# EAGLE design alimentadorV4 (EAGLE 6.6.0)
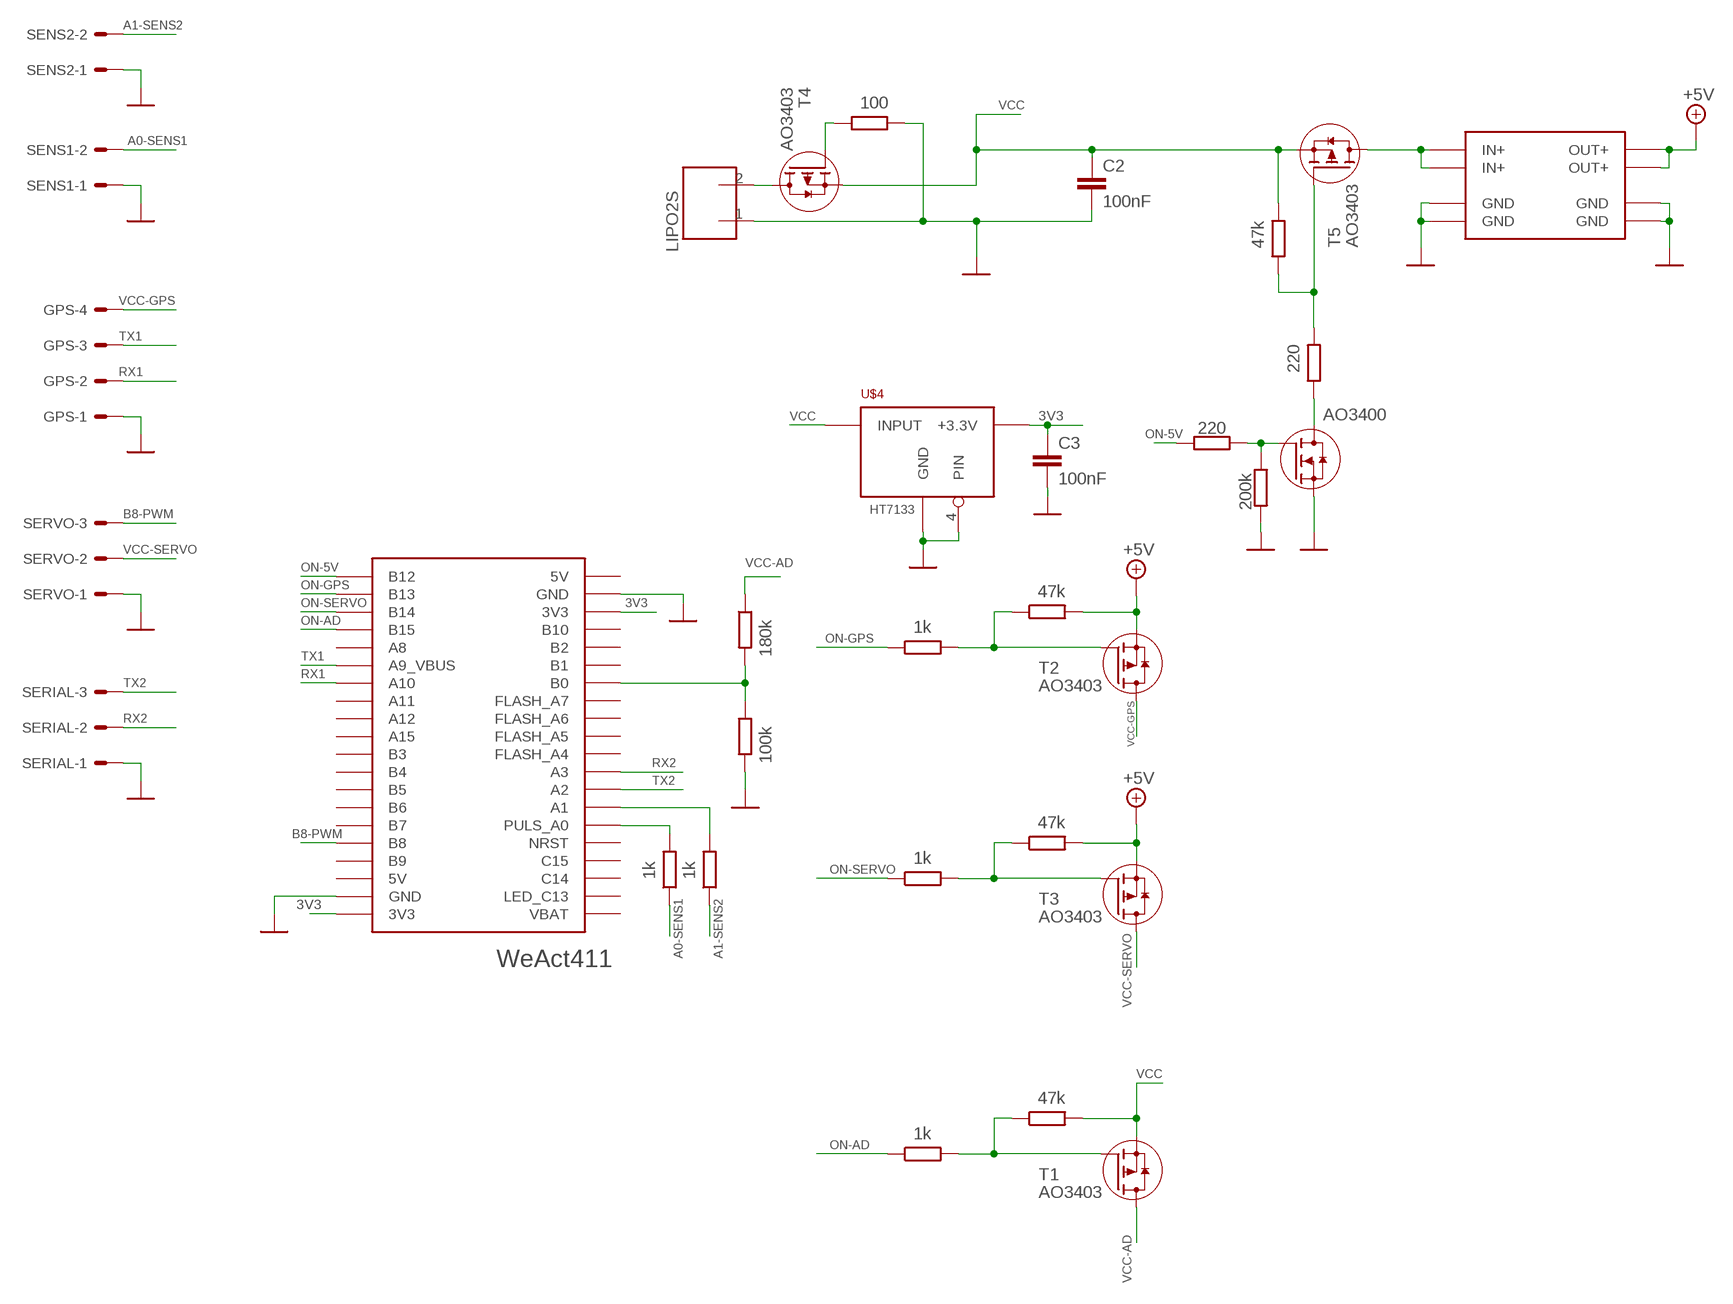
[diagram p0: schematic, sheet 1]

## Parts
C2  100nF  C-EUC1206  [C1206]
C3  100nF  C-EUC1206  [C1206]
GPS  22-27-2041-04  [6410-04]
LIPO2S  CONECTOR_2P-3.81  [CON2P-3.81]
R1  47k  R-EU_R1206  [R1206]
R2  100k  R-EU_R1206  [R1206]
R3  180k  R-EU_R1206  [R1206]
R4  1k  R-EU_R1206  [R1206]
R5  47k  R-EU_R1206  [R1206]
R6  1k  R-EU_R1206  [R1206]
R7  100  R-EU_R1206  [R1206]
R8  47k  R-EU_R1206  [R1206]
R9  220  R-EU_R1206  [R1206]
R10  220  R-EU_R1206  [R1206]
R11  47k  R-EU_R1206  [R1206]
R12  1k  R-EU_R1206  [R1206]
R13  1k  R-EU_R1206  [R1206]
R14  1k  R-EU_R1206  [R1206]
R15  200k  R-EU_R1206  [R1206]
SENS1  22-27-2021-02  [6410-02]
SENS2  22-27-2021-02  [6410-02]
SERIAL  22-27-2031-03  [6410-03]
SERVO  22-27-2031-03  [6410-03]
T1  AO3403  [SOT23]
T2  AO3403  [SOT23]
T3  AO3403  [SOT23]
T4  AO3403  [SOT23]
T5  AO3403  [SOT23]
U$1  AO3400  [SOT23]
U$2  WEACT411  [WEACT411]
U$3  REG12TO5  [REG12TO5]
U$4  HT7133  [SOT89]

## Nets
3V3: C3.1 U$2.3V3@1(3V3) U$2.3V3@2(3V3) U$4.2(+3.3V)
+5V: R1.2 R5.2 T2.2(S) T3.2(S) U$3.OUT+@1(OUT+) U$3.OUT+@2(OUT+)
A0-SENS1: R13.1 SENS1.2
A1-SENS2: R14.1 SENS2.2
B8-PWM: SERVO.3 U$2.B8
GND [pwr]: C2.2 C3.2 GPS.1 LIPO2S.1 R2.2 R7.2 R15.2 SENS1.1 SENS2.1 SERIAL.1 SERVO.1 U$1.2(S) U$2.GND@1(GND) U$2.GND@2(GND) U$3.GND@1(GND) U$3.GND@2(GND) U$3.GND@3(GND) U$3.GND@4(GND) U$4.3(GND) U$4.4(PIN)
KK: T5.3(D) U$3.IN+@1(IN+) U$3.IN+@2(IN+)
N$1: LIPO2S.2 T4.3(D)
N$2: R2.1 R3.2 U$2.B0
N$3: R7.1 T4.1(G)
N$4: R8.1 R9.2 T5.1(G)
N$5: R1.1 R4.2 T2.1(G)
N$6: R11.1 R12.2 T1.1(G)
N$7: R10.1 R15.1 U$1.1(G)
N$8: R5.1 R6.2 T3.1(G)
N$9: R13.2 U$2.A0(PULS_A0)
N$11: R14.2 U$2.A1
ON-5V: R10.2 U$2.B12
ON-AD: R12.1 U$2.B15
ON-GPS: R4.1 U$2.B13
ON-SERVO: R6.1 U$2.B14
RX1: GPS.2 U$2.A10
RX2: SERIAL.2 U$2.A3
TX1: GPS.3 U$2.A9(A9_VBUS)
TX2: SERIAL.3 U$2.A2
UU: R9.1 U$1.3(D)
VCC: C2.1 R8.2 R11.2 T1.2(S) T4.2(S) T5.2(S) U$4.1(INPUT)
VCC-AD: R3.1 T1.3(D)
VCC-GPS: GPS.4 T2.3(D)
VCC-SERVO: SERVO.2 T3.3(D)
Unconnected: U$2.5V@1(5V) U$2.5V@2(5V) U$2.A4(FLASH_A4) U$2.A5(FLASH_A5) U$2.A6(FLASH_A6) U$2.A7(FLASH_A7) U$2.A8 U$2.A11 U$2.A12 U$2.A15 U$2.B1 U$2.B2 U$2.B3 U$2.B4 U$2.B5 U$2.B6 U$2.B7 U$2.B9 U$2.B10 U$2.C13(LED_C13) U$2.C14 U$2.C15 U$2.NRST U$2.VBAT

## Library data of the parts
C2 C3 = rcl:C-EU: CAPACITOR, European symbol
GPS = con-molex:22-?-04: CONNECTOR wire to board 2.54 mm (.1 inch) pitch header; OC_FARNELL: unknown; OC_NEWARK: unknown
LIPO2S = jcf:CONECTOR_2P-3.81
R1-R15 = rcl:R-EU_: RESISTOR, European symbol
SENS1 SENS2 = con-molex:22-?-02: CONNECTOR wire to board 2.54 mm (.1 inch) pitch header; OC_FARNELL: unknown; OC_NEWARK: unknown
SERIAL SERVO = con-molex:22-?-03: CONNECTOR wire to board 2.54 mm (.1 inch) pitch header; OC_FARNELL: unknown; OC_NEWARK: unknown
T1-T5 = jcf:AO3403: AO3403 P-channel MOSFET 2.6A 30V
U$1 = jcf:AO3400: A3400 MOSFET-N 30V 5.8A 52mohm@Vgs2.5
U$2 = jcf:WEACT411: WeAct STM32F411
U$3 = jcf:REG12TO5: Regulador 12 a 5V
U$4 = jcf:HT7133: HT73333 Regulador LDO 3.3V Vinput max. 12V Iquiescent 4uA Imax 250mA

## Net classes
0 default: width 0.241 mm, drill 0.584 mm, clearance 0.241 mm
1 pwr: width 0.25 mm

## Board
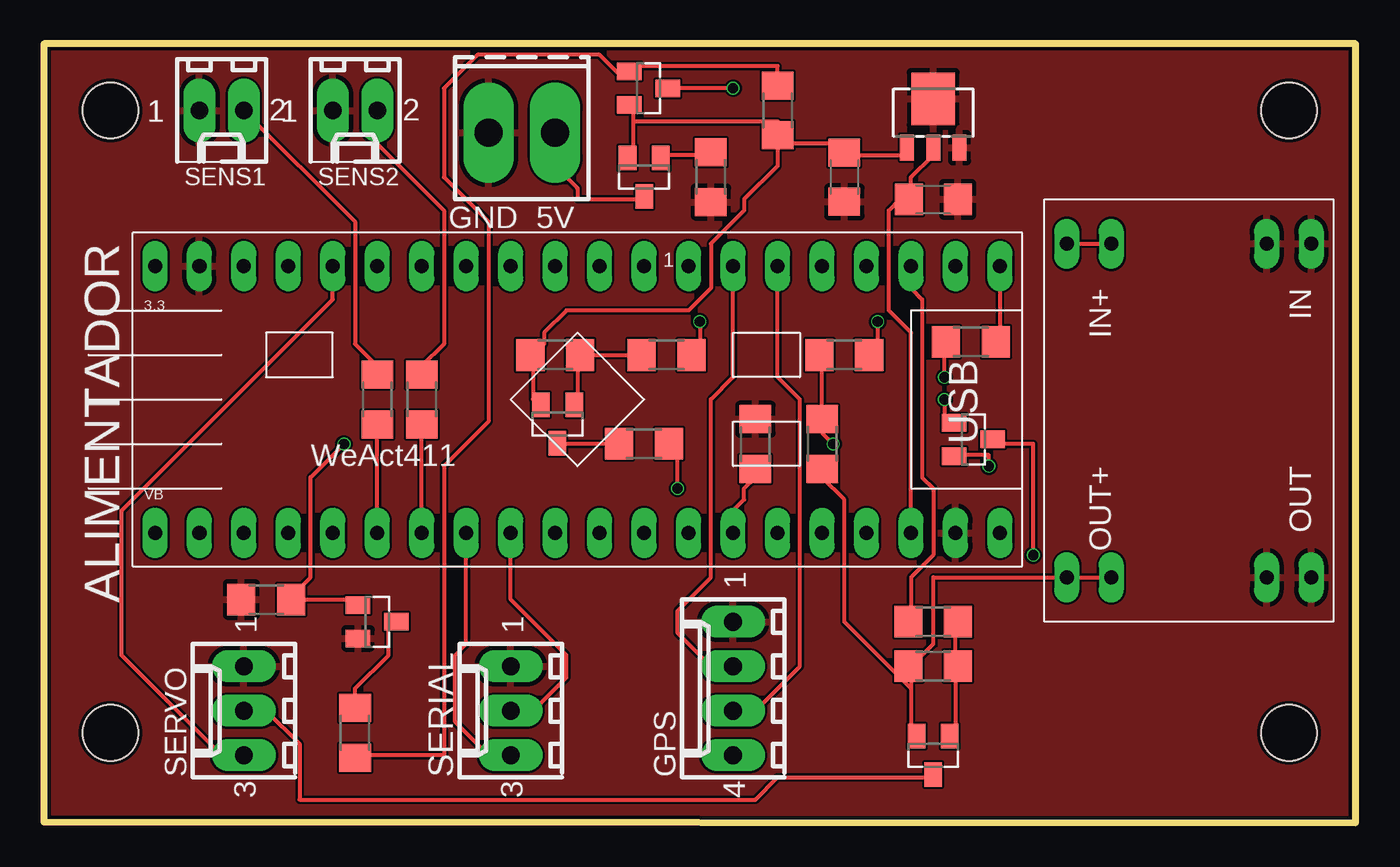
[diagram p1: board, top side]
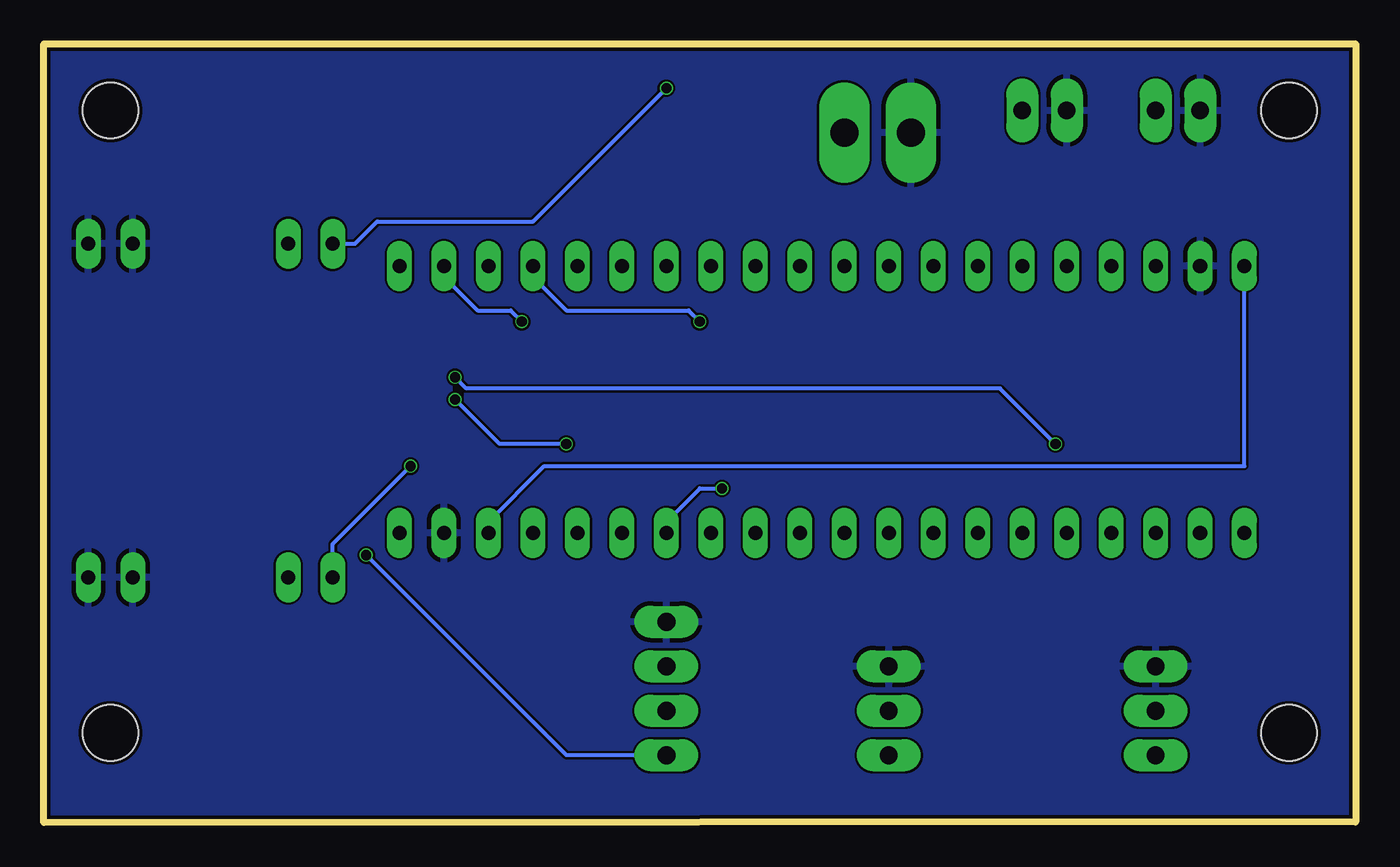
[diagram p2: board, bottom side, seen from below]

Size 74.93 x 44.5 mm. Coordinates in mm from the lower left corner, seen from the top.
Outline: 0,44.5 0,0.05 74.93,0 74.93,44.5 0,44.5
Copper layers (1*16): Top 0.035mm / dielectric 1.6mm / Bottom 0.035mm
Design rules "jlcpcb-2layers": minimum track width 5mil, minimum drill 0.3mm, track to track 5mil, track to pad 5mil, pad to pad 5mil, via to via 5mil, smd to smd 5mil, copper to edge 0.2mm, drill to drill 6mil, minimum pad ring 10mil, minimum via ring 3mil, stop-mask expansion 4mil, vias tented up to drill 0mil, thermal gap 10mil
Holes 3.2 mm at 71.12,5.13 3.81,5.13 71.12,40.69 3.81,40.69

### Footprints (pad centres in the part's own frame; a part is rotated, then mirrored left to right if it is on the bottom)
C1206 = smd 1.6 x 1.8: 1 -1.4,0; 2 1.4,0
6410-04 = drill 1.016 long: 1 3.81,0; 2 1.27,0; 3 -1.27,0; 4 -3.81,0
CON2P-3.81 = drill 1.6 long: 1 0,0; 2 3.81,0
R1206 = smd 1.6 x 1.803: 1 -1.422,0; 2 1.422,0
6410-02 = drill 1.016 long: 1 1.27,0; 2 -1.27,0
6410-03 = drill 1.016 long: 1 2.54,0; 2 0,0; 3 -2.54,0
SOT23 = smd 1 x 1.4: 1 -0.95,-1.1; 2 0.95,-1.1; 3 0,1.1
WEACT411 = drill 0.8 long: 3V3@1 43.18,0; 3V3@2 0,15.24; 5V@1 48.26,0; 5V@2 5.08,15.24; A0 12.7,0; A1 15.24,0; A2 17.78,0; A3 20.32,0; A4 22.86,0; A5 25.4,0; A6 27.94,0; A7 30.48,0; A8 38.1,15.24; A9 35.56,15.24; A10 33.02,15.24; A11 30.48,15.24; A12 27.94,15.24; A15 25.4,15.24; B0 33.02,0; B1 35.56,0; B2 38.1,0; B3 22.86,15.24; B4 20.32,15.24; B5 17.78,15.24; B6 15.24,15.24; B7 12.7,15.24; B8 10.16,15.24; B9 7.62,15.24; B10 40.64,0; B12 48.26,15.24; B13 45.72,15.24; B14 43.18,15.24; B15 40.64,15.24; C13 2.54,0; C14 5.08,0; C15 7.62,0; GND@1 45.72,0; GND@2 2.54,15.24; NRST 10.16,0; VBAT 0,0
REG12TO5 = drill 0.8 long: GND@1 0,11.43; GND@2 0,13.97; GND@3 19.05,11.43; GND@4 19.05,13.97; IN+@1 0,0; IN+@2 0,2.54; OUT+@1 19.05,0; OUT+@2 19.05,2.54
SOT89 = smd 0.8 x 1.5: 1 -1.5,-1.75; 2 0,-1.75; 3 1.5,-1.75 | smd 2.5 x 3: 4 0,1.05

### Placement (x,y rotation side)
C2  45.72,36.88 270 top
C3  50.8,35.61 0 top
GPS  39.37,7.67 90 top
LIPO2S  25.4,39.42 0 top
R1  44.45,21.64 270 top
R2  40.64,21.64 90 top
R3  34.29,21.64 0 top
R4  45.72,26.72 180 top
R5  50.8,8.94 180 top
R6  50.8,11.48 0 top
R7  38.1,36.88 270 top
R8  41.91,40.69 270 top
R9  17.78,5.13 270 top
R10  52.96,27.48 0 top
R11  29.21,26.72 180 top
R12  35.56,26.72 180 top
R13  19.05,24.18 270 top
R14  21.59,24.18 270 top
R15  12.7,12.75 180 top
SENS1  10.16,40.69 180 top
SENS2  17.78,40.69 180 top
SERIAL  26.67,6.4 90 top
SERVO  11.43,6.4 90 top
T1  29.34,22.78 180 top
T2  53.09,21.89 270 top
T3  50.8,3.86 180 top
T4  34.29,36.88 180 top
T5  34.54,41.96 270 top
U$1  19.05,11.48 270 top
U$2  6.35,16.56 0 top
U$3  58.42,33.07 270 top
U$4  50.8,40.31 0 top

### Tracks (layer width: path | path; a pad name or v marks a point on that pad's centre or on a via)
3V3
  Top 0.241: U$4.2 50.8,38.15 49.53,36.88 49.53,35.61 C3.1 48.9,35.61 48.26,34.98 48.26,29.26 49.53,27.99 U$2.3V3@1
  Bottom 0.241: U$2.3V3@2 6.35,20.37 46.36,20.37 49.53,17.2 U$2.3V3@1
+5V  (via drill 0.58)
  Top 0.241: v53.98,20.37 53.98,21.01 52.07,21.01 T2.2 | U$3.OUT+@2 U$3.OUT+@1 50.8,14.02 50.8,10.21 49.53,8.94 | 49.53,8.94 49.53,7.67 | 49.53,7.67 49.53,5.13 T3.2 | 49.53,7.67 45.72,11.48 45.72,18.47 44.45,19.74 R1.2 | 49.53,8.94 R5.2
  Bottom 0.241: v53.98,20.37 58.42,15.93 U$3.OUT+@1
A0-SENS1
  Top 0.241: SENS1.2 17.78,34.34 17.78,27.36 19.05,26.09 R13.1
A1-SENS2
  Top 0.241: SENS2.2 19.05,38.79 22.86,34.98 22.86,27.36 21.59,26.09 R14.1
B8-PWM
  Top 0.241: U$2.B8 16.51,29.9 4.45,17.83 4.45,9.58 10.16,3.86 SERVO.3
GND
  pour Bottom: 0,0.05 74.93,0.03 74.93,44.5 0,44.5
  pour Top: 0,44.5 74.93,44.5 74.93,0.03 0,0.05
KK  (via drill 0.58)
  Top 0.241: v39.37,41.96 T5.3 | U$3.IN+@1 U$3.IN+@2
  Bottom 0.241: v39.37,41.96 46.99,34.34 55.88,34.34 57.15,33.07 U$3.IN+@1
N$1
  Top 0.241: LIPO2S.2 29.21,37.52 30.48,36.25 30.48,35.61 34.29,35.61 T4.3
N$2  (via drill 0.58)
  Top 0.241: v36.2,19.1 36.2,21.64 R3.2 | U$2.B0 39.37,17.83 40.01,18.47 40.01,19.1 40.64,19.74 R2.1
  Bottom 0.241: v36.2,19.1 37.47,19.1 39.37,17.2 U$2.B0
N$3
  Top 0.241: T4.1 35.56,38.15 38.1,38.15 R7.1
N$4
  Top 0.241: R8.1 41.91,43.23 33.66,43.23 T5.1 33.02,42.6 31.75,43.87 24.76,43.87 22.86,41.96 22.86,36.88 25.4,34.34 25.4,22.91 22.86,20.37 22.86,3.86 17.78,3.86 R9.2
N$5  (via drill 0.58)
  Top 0.241: v51.44,24.18 51.44,22.91 T2.1 | v45.09,21.64 44.45,22.28 R1.1 44.45,26.72 R4.2
  Bottom 0.241: v51.44,24.18 48.9,21.64 v45.09,21.64
N$6
  Top 0.241: T1.1 30.48,24.18 30.48,26.72 R11.1 R12.2
N$7  (via drill 0.58)
  Top 0.241: 14.61,12.75 17.78,12.75 U$1.1 | v51.44,25.45 51.44,27.36 R10.1 | v17.14,21.64 15.24,19.74 15.24,14.02 14.61,13.39 14.61,12.75 | 14.61,12.75 R15.1
  Bottom 0.241: v51.44,25.45 50.8,24.82 20.32,24.82 v17.14,21.64
N$8
  Top 0.241: 52.07,8.94 52.07,5.13 T3.1 | 52.07,8.94 52.07,11.48 R6.2 | 52.07,8.94 R5.1
N$9
  Top 0.241: U$2.A0 R13.2
N$11
  Top 0.241: U$2.A1 R14.2
ON-5V
  Top 0.241: U$2.B12 54.61,27.99 R10.2
ON-AD  (via drill 0.58)
  Top 0.241: v37.47,28.63 37.47,26.72 R12.1
  Bottom 0.241: v37.47,28.63 38.1,29.26 45.09,29.26 46.99,31.17 U$2.B15
ON-GPS  (via drill 0.58)
  Top 0.241: v47.62,28.63 47.62,26.72 R4.1
  Bottom 0.241: v47.62,28.63 48.26,29.26 50.16,29.26 52.07,31.17 U$2.B13
ON-SERVO
  Top 0.241: U$2.B14 49.53,30.53 50.16,29.9 50.16,19.74 50.8,19.1 50.8,15.29 49.53,14.02 49.53,11.48 R6.1
RX1
  Top 0.241: U$2.A10 39.37,25.45 38.1,24.18 38.1,14.02 36.2,12.12 36.2,10.85 38.1,8.94 GPS.2
RX2
  Top 0.241: U$2.A3 26.67,12.75 29.84,9.58 29.84,8.31 27.94,6.4 SERIAL.2
TX1
  Top 0.241: U$2.A9 41.91,25.45 43.18,24.18 43.18,8.94 40.64,6.4 GPS.3
TX2
  Top 0.241: U$2.A2 24.13,10.21 23.49,9.58 23.49,5.77 25.4,3.86 SERIAL.3
UU
  Top 0.241: R9.1 17.78,7.67 19.68,9.58 19.68,11.48 U$1.3
VCC
  Top 0.241: 27.94,26.72 27.94,24.18 T1.2 | 33.66,40.06 33.66,40.69 T5.2 | 33.66,40.06 33.66,38.15 T4.2 | U$4.1 49.53,38.15 45.72,38.15 C2.1 45.72,38.79 41.91,38.79 | 33.66,40.06 41.91,40.06 R8.2 41.91,38.79 | 27.94,26.72 28.57,27.36 28.57,27.99 29.84,29.26 36.83,29.26 38.1,30.53 38.1,33.07 40.01,34.98 40.01,35.61 41.91,37.52 41.91,38.79 | 27.94,26.72 R11.2
VCC-AD
  Top 0.241: R3.1 29.21,21.64 T1.3
VCC-GPS  (via drill 0.58)
  Top 0.241: v56.52,15.29 56.52,21.64 54.61,21.64 T2.3
  Bottom 0.241: v56.52,15.29 45.09,3.86 GPS.4
VCC-SERVO
  Top 0.241: SERVO.2 12.7,6.4 14.61,4.5 14.61,1.32 40.64,1.32 41.91,2.59 50.8,2.59 T3.3

### Text on the board
tPlace: GND 5V
tNames: 1 | ALIMENTADOR